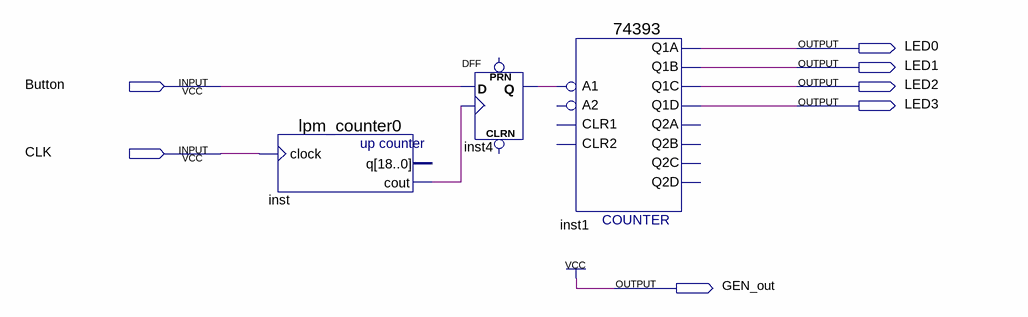
[diagram p0: schematic sheet]
// Quartus schematic lab6.bdf as structural Verilog: 3 symbols, 7 pins
module lab6 (
  input  Button,
  input  CLK,
  output LED0,
  output LED1,
  output LED2,
  output LED3,
  output GEN_out
);

  wire inst4_q, inst_cout;

  lpm_counter0 inst (.clock(CLK), .cout(inst_cout));  // open: q
  DFF inst4 (.CLK(inst_cout), .D(Button), .Q(inst4_q));  // open: CLRN, PRN
  \74393  inst1 (
    .A1(inst4_q), .Q1C(LED2), .Q1D(LED3), .Q1A(LED0), .Q1B(LED1));  // open: CLR1, A2, CLR2, Q2D, Q2C, Q2B, Q2A

  assign GEN_out = 1'b1;
endmodule
